# EAGLE design control-surface-right (EAGLE 6.6.0)
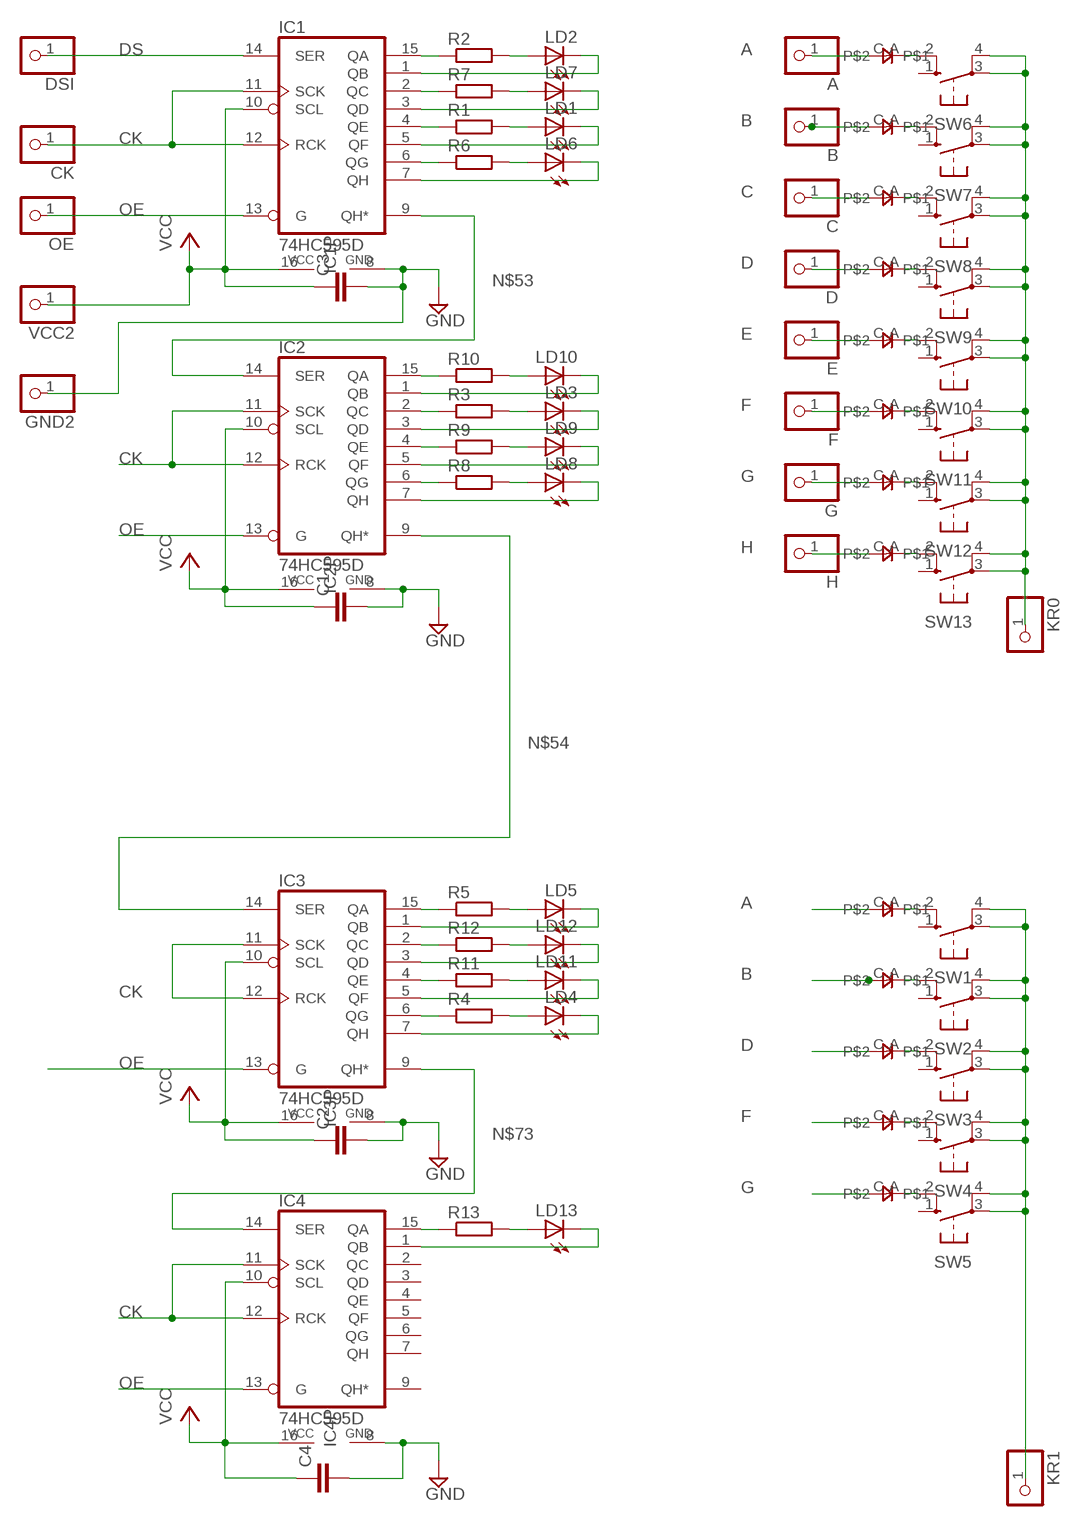
[diagram p0: schematic, sheet 1]

## Parts
A  PINHD-1X1  [1X01]
B  PINHD-1X1  [1X01]
C  PINHD-1X1  [1X01]
C1  C-EUC0805  [C0805]
C2  C-EUC0805  [C0805]
C3  C-EUC0805  [C0805]
C4  C-EUC0805  [C0805]
CK  PINHD-1X1  [1X01]
D  PINHD-1X1  [1X01]
D1  0805DIODE  [0805DIODE]
D2  0805DIODE  [0805DIODE]
D3  0805DIODE  [0805DIODE]
D4  0805DIODE  [0805DIODE]
D5  0805DIODE  [0805DIODE]
D6  0805DIODE  [0805DIODE]
D7  0805DIODE  [0805DIODE]
D8  0805DIODE  [0805DIODE]
D9  0805DIODE  [0805DIODE]
D10  0805DIODE  [0805DIODE]
D11  0805DIODE  [0805DIODE]
D12  0805DIODE  [0805DIODE]
D13  0805DIODE  [0805DIODE]
DSI  PINHD-1X1  [1X01]
E  PINHD-1X1  [1X01]
F  PINHD-1X1  [1X01]
G  PINHD-1X1  [1X01]
GND2  PINHD-1X1  [1X01]
H  PINHD-1X1  [1X01]
IC1  74HC595D  [SO16]
IC2  74HC595D  [SO16]
IC3  74HC595D  [SO16]
IC4  74HC595D  [SO16]
KR0  PINHD-1X1  [1X01]
KR1  PINHD-1X1  [1X01]
LD1  LED3MM  [LED3MM]
LD2  LED3MM  [LED3MM]
LD3  LED3MM  [LED3MM]
LD4  LED3MM  [LED3MM]
LD5  LED3MM  [LED3MM]
LD6  LED3MM  [LED3MM]
LD7  LED3MM  [LED3MM]
LD8  LED3MM  [LED3MM]
LD9  LED3MM  [LED3MM]
LD10  LED3MM  [LED3MM]
LD11  LED3MM  [LED3MM]
LD12  LED3MM  [LED3MM]
LD13  LED3MM  [LED3MM]
OE  PINHD-1X1  [1X01]
R1  R-EU_R0805  [R0805]
R2  R-EU_R0805  [R0805]
R3  R-EU_R0805  [R0805]
R4  R-EU_R0805  [R0805]
R5  R-EU_R0805  [R0805]
R6  R-EU_R0805  [R0805]
R7  R-EU_R0805  [R0805]
R8  R-EU_R0805  [R0805]
R9  R-EU_R0805  [R0805]
R10  R-EU_R0805  [R0805]
R11  R-EU_R0805  [R0805]
R12  R-EU_R0805  [R0805]
R13  R-EU_R0805  [R0805]
SW1  40-XX  [B3F-40XX]
SW2  40-XX  [B3F-40XX]
SW3  40-XX  [B3F-40XX]
SW4  40-XX  [B3F-40XX]
SW5  40-XX  [B3F-40XX]
SW6  40-XX  [B3F-40XX]
SW7  40-XX  [B3F-40XX]
SW8  40-XX  [B3F-40XX]
SW9  40-XX  [B3F-40XX]
SW10  40-XX  [B3F-40XX]
SW11  40-XX  [B3F-40XX]
SW12  40-XX  [B3F-40XX]
SW13  40-XX  [B3F-40XX]
VCC2  PINHD-1X1  [1X01]

## Nets
A: A.1 D1.C D6.C
B: B.1 D2.C D7.C
C: C.1 D8.C
CK: CK.1 IC1.11(SCK) IC1.12(RCK) IC2.11(SCK) IC2.12(RCK) IC3.11(SCK) IC3.12(RCK) IC4.11(SCK) IC4.12(RCK)
D: D3.C D9.C D.1
DS: DSI.1 IC1.14(SER)
E: D10.C E.1
F: D4.C D11.C F.1
G: D5.C D12.C G.1
GND: C1.2 C2.2 C3.2 C4.2 GND2.1 IC1.8(GND) IC2.8(GND) IC3.8(GND) IC4.8(GND)
H: D13.C H.1
N$1: IC1.6(QG) R6.1
N$2: LD6.A R6.2
N$3: IC1.7(QH) LD6.K(C)
N$4: IC1.4(QE) R1.1
N$5: IC1.5(QF) LD1.K(C)
N$6: LD1.A R1.2
N$7: IC1.3(QD) LD7.K(C)
N$8: LD7.A R7.2
N$9: IC1.2(QC) R7.1
N$10: IC1.15(QA) R2.1
N$11: IC1.1(QB) LD2.K(C)
N$12: LD2.A R2.2
N$14: IC2.6(QG) R8.1
N$15: LD8.A R8.2
N$16: IC2.7(QH) LD8.K(C)
N$17: IC2.4(QE) R9.1
N$18: IC2.5(QF) LD9.K(C)
N$19: LD9.A R9.2
N$20: IC2.3(QD) LD3.K(C)
N$21: LD3.A R3.2
N$22: IC2.2(QC) R3.1
N$23: IC2.15(QA) R10.1
N$24: IC2.1(QB) LD10.K(C)
N$25: LD10.A R10.2
N$27: KR0.1 SW6.3(P) SW6.4(P1) SW7.3(P) SW7.4(P1) SW8.3(P) SW8.4(P1) SW9.3(P) SW9.4(P1) SW10.3(P) SW10.4(P1) SW11.3(P) SW11.4(P1) SW12.3(P) SW12.4(P1) SW13.3(P) SW13.4(P1)
N$28: D13.A SW13.2(S1)
N$29: D12.A SW12.2(S1)
N$30: D11.A SW11.2(S1)
N$31: D10.A SW10.2(S1)
N$32: D9.A SW9.2(S1)
N$33: D8.A SW8.2(S1)
N$34: D7.A SW7.2(S1)
N$35: D6.A SW6.2(S1)
N$45: IC3.6(QG) R4.1
N$46: LD4.A R4.2
N$47: IC3.7(QH) LD4.K(C)
N$48: IC3.4(QE) R11.1
N$49: IC3.5(QF) LD11.K(C)
N$50: LD11.A R11.2
N$51: IC3.3(QD) LD12.K(C)
N$52: LD12.A R12.2
N$53: IC1.9(QH*) IC2.14(SER)
N$54: IC2.9(QH*) IC3.14(SER)
N$55: IC3.2(QC) R12.1
N$56: IC3.15(QA) R5.1
N$57: IC3.1(QB) LD5.K(C)
N$58: LD5.A R5.2
N$69: IC4.15(QA) R13.1
N$70: IC4.1(QB) LD13.K(C)
N$71: LD13.A R13.2
N$73: IC3.9(QH*) IC4.14(SER)
N$75: KR1.1 SW1.3(P) SW1.4(P1) SW2.3(P) SW2.4(P1) SW3.3(P) SW3.4(P1) SW4.3(P) SW4.4(P1) SW5.3(P) SW5.4(P1)
N$79: D5.A SW5.2(S1)
N$80: D4.A SW4.2(S1)
N$81: D3.A SW3.2(S1)
N$82: D2.A SW2.2(S1)
N$83: D1.A SW1.2(S1)
OE: IC1.13(G) IC2.13(G) IC3.13(G) IC4.13(G) OE.1
VCC: C1.1 C2.1 C3.1 C4.1 IC1.10(SCL) IC1.16(VCC) IC2.10(SCL) IC2.16(VCC) IC3.10(SCL) IC3.16(VCC) IC4.10(SCL) IC4.16(VCC) VCC2.1
Unconnected: IC4.2(QC) IC4.3(QD) IC4.4(QE) IC4.5(QF) IC4.6(QG) IC4.7(QH) IC4.9(QH*) SW1.1(S) SW2.1(S) SW3.1(S) SW4.1(S) SW5.1(S) SW6.1(S) SW7.1(S) SW8.1(S) SW9.1(S) SW10.1(S) SW11.1(S) SW12.1(S) SW13.1(S)

## Library data of the parts
A B C CK D DSI E F G GND2 H KR0 KR1 OE VCC2 = pinhead:PINHD-1X1: PIN HEADER
C1-C4 = rcl:C-EU: CAPACITOR, European symbol
D1-D13 = jasons_stuff:0805DIODE
IC1-IC4 = 74xx-eu:74*595: 8-bit SHIFT REGISTER, output latch
LD1-LD13 = led:LED: LED OSRAM: - CHIPLED LG R971, LG N971, LY N971, LG Q971, LY Q971, LO R971, LY R971 LH N974, LH R974 LS Q976, LO Q976, LY Q976 LO Q996 - Hyper CHIPLED LW Q18S LB Q993, LB Q99A, LB R99A - SideLED LS A670, LO A670, LY A670, LG A670, LP A670 LB A673, LV A673, LT A673, LW A673 LH A674 LY A675 LS A676, LA A676, LO A676, LY A676, LW A676 LS A679, LY A679, LG A679 - Hyper Micro SIDELED® LS Y876, LA Y876, LO Y876, LY Y876 LT Y87S - SmartLED LW L88C, LW L88S LB L89C, LB L89S, LG L890 LS L89K, LO L89K, LY L89K LS L896, LA L896, LO L896, LY L896 - TOPLED LS T670, LO T670, LY T670, LG T670, LP T670 LSG T670, LSP T670, LSY T670, LOP T670, LYG T670 LG T671, LOG T671, LSG T671 LB T673, LV T673, LT T673, LW T673 LH T674 LS T676, LA T676, LO T676, LY T676, LB T676, LH T676, LSB T676, LW T676 LB T67C, LV T67C, LT T67C, LS T67K, LO T67K, LY T67K, LW E67C LS E67B, LA E67B, LO E67B, LY E67B, LB E67C, LV E67C, LT E67C LW T67C LS T679, LY T679, LG T679 LS T770, LO T770, LY T770, LG T770, LP T770 LB T773, LV T773, LT T773, LW T773 LH T774 LS E675, LA E675, LY E675, LS T675 LS T776, LA T776, LO T776, LY T776, LB T776 LHGB T686 LT T68C, LB T68C - Hyper Mini TOPLED® LB M676 - Mini TOPLED Santana® LG M470 LS M47K, LO M47K, LY M47K Source: http://www.osram.convergy.de LUXEON: - LUMILED® LXK2-PW12-R00, LXK2-PW12-S00, LXK2-PW14-U00, LXK2-PW14-V00 LXK2-PM12-R00, LXK2-PM12-S00, LXK2-PM14-U00 LXK2-PE12-Q00, LXK2-PE12-R00, LXK2-PE12-S00, LXK2-PE14-T00, LXK2-PE14-U00 LXK2-PB12-K00, LXK2-PB12-L00, LXK2-PB12-M00, LXK2-PB14-N00, LXK2-PB14-P00, LXK2-PB14-Q00 LXK2-PR12-L00, LXK2-PR12-M00, LXK2-PR14-Q00, LXK2-PR14-R00 LXK2-PD12-Q00, LXK2-PD12-R00, LXK2-PD12-S00 LXK2-PH12-R00, LXK2-PH12-S00 LXK2-PL12-P00, LXK2-PL12-Q00, LXK2-PL12-R00 Source: www.luxeon.com KINGBRIGHT: KA-3528ASYC Source: www.kingbright.com
R1-R13 = rcl:R-EU_: RESISTOR, European symbol
SW1-SW13 = switch-omron:40-XX: OMRON SWITCH; MF: OMRON COMPONENTS USA; MPN: B3F-4000; OC_FARNELL: 176434; OC_NEWARK: 36K3105

## Board
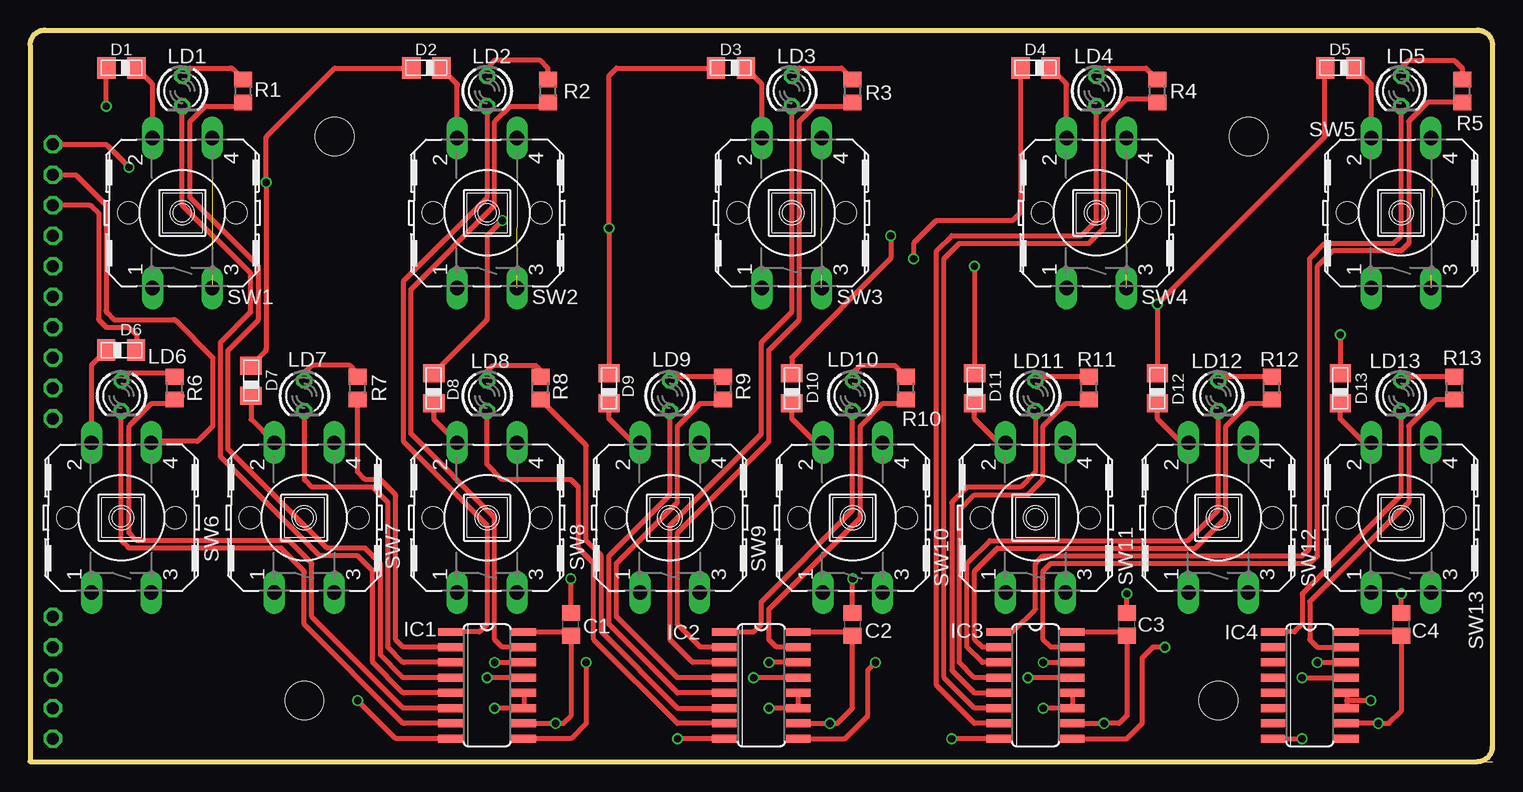
[diagram p1: board, top side]
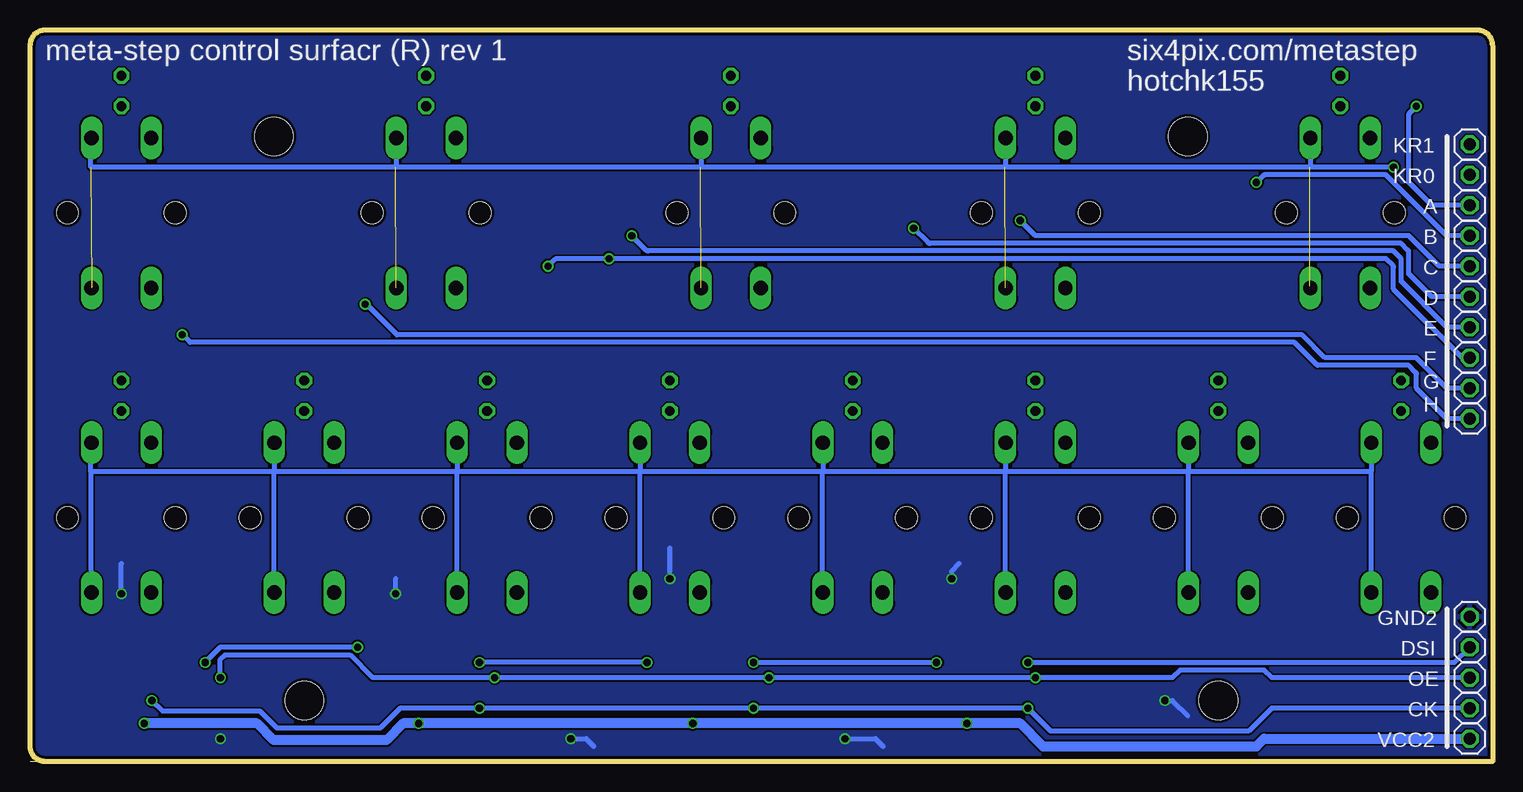
[diagram p2: board, bottom side, seen from below]

Size 121.92 x 60.96 mm. Coordinates in mm from the lower left corner, seen from the top.
Outline: 0,0 121.92,0
Outline: 0,0 0,59.69 arc-90 1.27,60.96 120.65,60.96 arc-90 121.92,59.69 121.92,1.27 arc-90 120.65,0 0,0
Copper layers (1*16): Top 0.035mm / dielectric 1.5mm / Bottom 0.035mm
Design rules "ITEADstudio_DRC": minimum track width 6mil, minimum drill 12mil, track to track 6mil, track to pad 6mil, pad to pad 6mil, via to via 6mil, smd to smd 0mil, copper to edge 10mil, drill to drill 10mil, minimum pad ring 10mil, minimum via ring 6mil, stop-mask expansion 2mil, vias tented up to drill 100mil, thermal gap 10mil
Holes 3.2 mm at 25.4,52.07 101.6,52.07 22.86,5.08 99.06,5.08

### Footprints (pad centres in the part's own frame; a part is rotated, then mirrored left to right if it is on the bottom)
1X01 = drill 1.016 octagon: 1 0,0
C0805 = smd 1.3 x 1.5: 1 -0.95,0; 2 0.95,0
0805DIODE = smd 1.524 x 1.778: A -1.262,-0.005; C 1.238,-0.005
SO16 = smd 0.66 x 2.032: 1 -4.445,-3.073; 2 -3.175,-3.073; 3 -1.905,-3.073; 4 -0.635,-3.073; 5 0.635,-3.073; 6 1.905,-3.073; 7 3.175,-3.073; 8 4.445,-3.073; 9 4.445,3.073; 10 3.175,3.073; 11 1.905,3.073; 12 0.635,3.073; 13 -0.635,3.073; 14 -1.905,3.073; 15 -3.175,3.073; 16 -4.445,3.073
LED3MM = drill 0.813 octagon: A -1.27,0; K 1.27,0
R0805 = smd 1.3 x 1.5: 1 -0.95,0; 2 0.95,0
B3F-40XX = drill 1.194 long: 1 -6.248,2.489; 2 6.248,2.489; 3 -6.248,-2.489; 4 6.248,-2.489 | hole 1.803: 0,-4.496; 0,4.496

### Placement (x,y rotation side)
A  1.9,46.35 0 bottom
B  1.9,43.81 0 bottom
C  1.9,41.27 0 bottom
C1  45.09,11.43 90 top
C2  68.58,11.43 90 top
C3  91.44,11.43 90 top
C4  114.3,11.43 90 top
CK  1.9,4.45 0 bottom
D  1.9,38.73 0 bottom
D1  7.62,57.78 180 top
D2  33.02,57.78 180 top
D3  58.42,57.78 180 top
D4  83.82,57.78 180 top
D5  109.22,57.78 180 top
D6  7.62,34.29 0 top
D7  18.41,31.75 90 top
D8  33.66,31.11 90 top
D9  48.26,31.11 90 top
D10  63.5,31.11 90 top
D11  78.74,31.11 90 top
D12  93.98,31.11 90 top
D13  109.22,31.11 90 top
DSI  1.9,9.53 0 bottom
E  1.9,36.2 0 bottom
F  1.9,33.66 0 bottom
G  1.9,31.11 0 bottom
GND2  1.9,12.06 0 bottom
H  1.9,28.57 0 bottom
IC1  38.1,6.35 270 top
IC2  60.96,6.35 270 top
IC3  83.82,6.35 270 top
IC4  106.68,6.35 270 top
KR0  1.9,48.9 0 bottom
KR1  1.9,51.44 0 bottom
LD1  12.7,55.88 270 top
LD2  38.1,55.88 270 top
LD3  63.5,55.88 270 top
LD4  88.9,55.88 270 top
LD5  114.3,55.88 270 top
LD6  7.62,30.48 270 top
LD7  22.86,30.48 270 top
LD8  38.1,30.48 270 top
LD9  53.34,30.48 270 top
LD10  68.58,30.48 270 top
LD11  83.82,30.48 270 top
LD12  99.06,30.48 270 top
LD13  114.3,30.48 270 top
OE  1.9,6.99 0 bottom
R1  17.78,55.88 90 top
R2  43.18,55.88 90 top
R3  68.58,55.88 90 top
R4  93.98,55.88 90 top
R5  119.38,55.88 90 top
R6  12.06,31.11 90 top
R7  27.3,31.11 90 top
R8  42.55,31.11 90 top
R9  57.78,31.11 90 top
R10  73.03,31.11 90 top
R11  88.27,31.11 90 top
R12  103.5,31.11 90 top
R13  118.75,31.11 90 top
SW1  12.7,45.72 90 top
SW2  38.1,45.72 90 top
SW3  63.5,45.72 90 top
SW4  88.9,45.72 90 top
SW5  114.3,45.72 90 top
SW6  7.62,20.32 90 top
SW7  22.86,20.32 90 top
SW8  38.1,20.32 90 top
SW9  53.34,20.32 90 top
SW10  68.58,20.32 90 top
SW11  83.82,20.32 90 top
SW12  99.06,20.32 90 top
SW13  114.3,20.32 90 top
VCC2  1.9,1.91 0 bottom

### Tracks (layer width: path | path; a pad name or v marks a point on that pad's centre or on a via)
A  (via drill 0.6)
  Top 0.406: D6.C arc45 8.89,34.36 8.89,35.56 8.33,36.12 arc45 8.15,36.2 6.35,36.2 5.79,36.76 arc-45 5.71,36.94 5.71,45.72 5.15,46.28 arc45 4.97,46.35 A.1 | v6.35,54.61 6.35,57.71 arc-45 D1.C
  Bottom 0.406: A.1 4.97,46.35 arc45 5.15,46.43 6.98,48.26 6.98,53.87 arc45 6.91,54.05 v6.35,54.61
B  (via drill 0.6)
  Top 0.406: D7.C 19.61,34.18 arc45 19.69,34.36 v19.69,48.26 19.69,51.97 arc-45 19.76,52.14 25.4,57.78 D2.C arc45 D2.C
  Bottom 0.406: B.1 3.7,43.81 arc45 3.88,43.89 8.89,48.9 18.95,48.9 arc-45 19.12,48.82 v19.69,48.26
C  (via drill 0.6)
  Top 0.406: v39.37,45.09 38.1,43.81 38.1,36.9 arc-45 38.03,36.72 D8.C
  Bottom 0.406: C.1 4.34,41.27 arc45 4.52,41.35 6.98,43.81 37.99,43.81 arc45 38.17,43.89 v39.37,45.09
CK  (via drill 0.6)
  Top 0.406: v61.59,4.45 IC2.11 IC2.12 | v38.73,4.45 IC1.11 IC1.12 | IC3.12 IC3.11 v84.45,4.45 | IC4.12 109.75,5.08 | 109.75,5.08 IC4.11 | v111.76,5.08 109.75,5.08
  Bottom 0.406: CK.1 18.41,4.45 20.32,2.54 36.83,2.54 v38.73,4.45 v61.59,4.45 v84.45,4.45 91.06,4.45 92.71,2.79 101.35,2.79 102.74,4.19 110.87,4.19 v111.76,5.08
D  (via drill 0.6)
  Top 0.406: D9.C arc-45 48.26,32.37 v48.26,44.45 48.26,57.05 arc-45 48.33,57.22 48.89,57.78 D3.C arc45 D3.C
  Bottom 0.406: D.1 4.97,38.73 arc45 5.15,38.81 6.98,40.64 6.98,42.44 arc-45 7.06,42.62 7.62,43.18 46.89,43.18 arc45 47.06,43.25 v48.26,44.45
DS  (via drill 0.6)
  Top 0.406: v38.73,8.26 IC1.14
  Bottom 0.406: v38.73,8.26 3.17,8.26 DSI.1
E  (via drill 0.6)
  Top 0.406: v71.75,43.81 71.75,42.02 arc-45 71.68,41.84 63.5,33.66 63.5,32.37 arc45 D10.C
  Bottom 0.406: E.1 3.7,36.2 arc45 3.88,36.27 7.62,40.01 7.62,41.8 arc-45 7.69,41.98 8.25,42.55 70.38,42.55 arc45 70.56,42.62 v71.75,43.81
F  (via drill 0.6)
  Top 0.406: v78.74,41.27 78.74,32.37 arc45 D11.C | D4.C 82.58,45.86 arc-45 82.51,45.68 81.91,45.09 75.67,45.09 arc45 75.49,45.01 73.66,43.18 v73.66,41.91
  Bottom 0.406: v78.74,41.27 78.18,41.84 arc45 78,41.91 74.93,41.91 v73.66,41.91 8.89,41.91 8.33,41.35 arc45 8.25,41.17 8.25,39.37 2.54,33.66 F.1
G  (via drill 0.6)
  Top 0.406: D12.C arc-45 93.98,32.37 v93.98,38.1 107.95,52.07 107.95,57.71 arc-45 D5.C
  Bottom 0.406: G.1 3.7,31.11 arc45 3.88,31.19 6.35,33.66 13.97,33.66 15.88,35.56 91.33,35.56 93.88,38.1 v93.98,38.1
GND  (via drill 0.6)
  Top 0.406: IC1.8 30.48,1.91 v27.3,5.08 | IC2.8 v53.97,1.91 | IC3.8 v76.83,1.91 | IC4.8 v106.05,1.91 | C4.2 v114.3,13.97 | C3.2 v91.44,13.97 | C2.2 v68.58,15.24 | C1.2 v45.09,15.24
  Bottom 0.406: v27.3,5.08 26.67,5.08 25.4,3.81 | v53.97,1.91 51.44,1.91 50.8,1.27 | v76.83,1.91 75.56,1.91 74.93,1.27 | v114.3,13.97 114.3,16.51 | v91.44,13.97 91.44,15.24 | v68.58,15.24 68.58,17.78 | v45.09,15.24 45.09,15.88 44.45,16.51
  pour Bottom: -1.27,64.77 -1.27,-3.81 -1.27,-6.35 125.73,-6.35 125.73,64.77 127,64.77 127,67.31 -1.27,67.31
H  (via drill 0.6)
  Top 0.406: v109.22,35.56 109.22,32.37 arc45 D13.C
  Bottom 0.406: H.1 3.7,28.57 arc45 3.88,28.65 6.35,31.11 6.35,32.28 arc-45 6.42,32.46 6.98,33.02 14.6,33.02 16.51,34.92 108.58,34.92 v109.22,35.56
N$1
  Top 0.406: IC1.6 31.22,4.45 arc-45 31.04,4.52 23.49,12.06 23.49,16.41 arc45 23.42,16.58 21.59,18.41 8.99,18.41 arc-45 8.82,18.49 8.25,19.05 8.25,27.84 arc-45 8.33,28.01 10.16,29.84 11.96,29.84 arc45 12.14,29.92 12.7,30.48 12.48,30.48 arc45 12.31,30.41 R6.1
N$2
  Top 0.406: LD6.A 8.25,32.38 11.64,32.38 arc-45 11.82,32.31 R6.2
N$3
  Top 0.406: IC1.7 31.22,3.17 arc-45 31.04,3.25 22.86,11.43 22.86,15.77 arc45 22.79,15.95 20.95,17.78 8.36,17.78 arc-45 8.18,17.85 7.62,18.41 LD6.K
N$4
  Top 0.406: IC1.4 31.22,6.99 arc-45 31.04,7.06 29.21,8.89 29.21,16.41 arc45 29.14,16.58 27.94,17.78 24.87,17.78 arc-45 24.69,17.85 16.51,26.04 16.51,34.19 arc-45 16.58,34.36 19.05,36.83 19.05,41.17 arc45 18.98,41.35 13.33,46.99 13.33,53.23 arc-45 13.41,53.41 14.6,54.61 17.35,54.61 arc45 17.53,54.68 R1.1
N$5
  Top 0.406: IC1.5 31.22,5.71 arc-45 31.04,5.79 28.57,8.26 28.57,15.77 arc45 28.5,15.95 27.3,17.14 24.23,17.14 arc-45 24.06,17.22 15.88,25.4 15.88,34.82 arc-45 15.95,35 18.41,37.47 18.41,40.53 arc45 18.34,40.71 12.7,46.35 LD1.K
N$6
  Top 0.406: LD1.A 13.33,57.78 16.72,57.78 arc-45 16.9,57.71 R1.2
N$7
  Top 0.406: IC1.3 31.22,8.26 arc-45 31.04,8.33 29.84,9.53 29.84,21.48 arc45 29.77,21.66 28.57,22.86 23.49,22.86 22.93,23.42 arc-45 22.86,23.6 LD7.K
N$8
  Top 0.406: R7.2 27.3,32.28 arc45 27.23,32.46 26.67,33.02 23.6,33.02 arc45 23.42,32.95 22.86,32.38 LD7.A
N$9
  Top 0.406: IC1.2 31.22,9.53 arc-45 31.04,9.6 30.48,10.16 30.48,22.12 arc45 30.41,22.3 29.21,23.5 28.05,23.5 arc-45 27.87,23.57 27.3,24.13 R7.1
N$10
  Top 0.406: IC1.15 39.37,9.53 38.73,10.16 38.73,20.32 31.75,27.3 31.75,39.37 38.73,46.35 38.73,53.34 40,54.61 42.86,54.61 R2.1
N$11
  Top 0.406: LD2.K 38.1,46.99 31.12,40.01 31.12,26.77 arc45 31.19,26.6 38.1,19.68 38.1,11.54 arc-45 38.03,11.36 37.46,10.79 IC1.1
N$12
  Top 0.406: R2.2 43.18,57.78 42.55,58.42 38.73,58.42 38.1,57.78 LD2.A
N$14
  Top 0.406: R8.1 46.36,26.36 46.36,18.41 47.62,17.14 47.62,10.79 53.97,4.45 IC2.6
N$15
  Top 0.406: LD8.A 38.1,32.51 38.61,33.02 42.16,33.02 42.42,32.77 42.42,32.19 R8.2
N$16
  Top 0.406: IC2.7 53.97,3.17 46.99,10.16 46.99,16.51 45.72,17.78 45.72,22.86 45.09,23.5 39.37,23.5 38.1,24.77 LD8.K
N$17
  Top 0.406: IC2.4 53.97,6.99 48.89,12.06 48.89,16.51 53.97,21.59 53.97,27.94 55.88,29.84 57.47,29.84 R9.1
N$18
  Top 0.406: LD9.K 53.34,22.23 48.26,17.14 48.26,11.43 53.97,5.71 IC2.5
N$19
  Top 0.406: R9.2 53.66,32.06 LD9.A
N$20
  Top 0.406: IC2.3 55.25,8.26 53.34,10.16 53.34,19.68 60.96,27.3 60.96,34.92 63.5,37.47 LD3.K
N$21
  Top 0.406: LD3.A 64.14,57.78 67.62,57.78 R3.2
N$22
  Top 0.406: IC2.2 55.88,9.53 53.97,11.43 53.97,19.05 61.59,26.67 61.59,34.29 64.14,36.83 64.14,53.34 65.41,54.61 68.26,54.61 R3.1
N$23
  Top 0.406: IC2.15 62.23,9.53 61.59,10.16 61.59,12.7 69.22,20.32 69.22,27.94 71.12,29.84 72.7,29.84 R10.1
N$24
  Top 0.406: IC2.1 60.33,10.79 60.96,11.43 60.96,13.34 68.58,20.95 LD10.K
N$25
  Top 0.406: LD10.A 68.58,32.38 69.22,33.02 72.07,33.02 R10.2
N$27
  Top 0.406: KR0.1 3.7,48.9 arc-45 3.88,48.82 6.35,46.35 6.35,37.57 arc45 6.42,37.39 6.98,36.83 11.96,36.83 arc-45 12.14,36.76 15.24,33.66 15.24,28.05 arc-45 15.17,27.87 13.97,26.67 10.32,26.67 arc45 10.14,26.6 SW6.4
  Bottom 0.406: SW6.4 10.11,24.18 10.16,24.13 | 10.16,24.13 25.4,24.13 | 25.4,24.13 40.64,24.13 | 40.64,24.13 55.88,24.13 | 55.88,24.13 71.12,24.13 | 71.12,24.13 86.36,24.13 | 86.36,24.13 101.6,24.13 | 101.6,24.13 116.84,24.13 | 116.84,24.13 116.84,26.52 SW13.4 | SW12.4 101.55,24.18 101.6,24.13 | SW11.4 86.31,24.18 86.36,24.13 | SW10.4 71.07,24.18 71.12,24.13 | SW9.4 55.83,24.18 55.88,24.13 | SW8.4 40.59,24.18 40.64,24.13 | SW7.4 25.35,24.18 25.4,24.13 | 10.16,24.13 10.16,14.12 SW6.3 | 25.4,24.13 25.4,14.12 SW7.3 | 40.64,24.13 40.64,14.02 | 40.64,13.97 40.64,14.02 | 40.64,14.02 SW8.3 | 55.88,24.13 55.88,14.12 SW9.3 | 71.12,24.13 71.12,14.12 SW10.3 | 86.36,24.13 86.36,14.12 SW11.3 | 101.6,24.13 101.6,14.12 SW12.3 | 116.84,24.13 116.84,14.12 SW13.3
N$28
  Top 0.406: SW13.2 111.23,26.57 109.22,28.57 D13.A
N$29
  Top 0.406: SW12.2 95.99,26.57 93.98,28.57 D12.A
N$30
  Top 0.406: SW11.2 80.75,26.57 78.74,28.57 D11.A
N$31
  Top 0.406: SW10.2 65.51,26.57 63.5,28.57 D10.A
N$32
  Top 0.406: SW9.2 50.27,26.57 48.26,28.57 D9.A
N$33
  Top 0.406: D8.A 33.66,28.52 SW8.2
N$34
  Top 0.406: D7.A 18.42,28.52 SW7.2
N$35
  Top 0.406: SW6.2 5.13,33.06 D6.A
N$45
  Top 0.406: IC3.6 78.74,4.45 76.2,6.99 76.2,41.91 77.47,43.18 88.27,43.18 89.53,44.45 89.53,53.34 91.44,55.24 93.66,55.24 R4.1
N$46
  Top 0.406: LD4.A 89.53,57.78 93.03,57.78 R4.2
N$47
  Top 0.406: IC3.7 78.74,3.17 75.56,6.35 75.56,42.55 76.83,43.81 87.63,43.81 88.9,45.09 LD4.K
N$48
  Top 0.406: IC3.4 78.74,6.99 77.47,8.26 77.47,20.95 78.74,22.23 83.19,22.23 84.45,23.5 84.45,27.94 86.36,29.84 87.94,29.84 R11.1
N$49
  Top 0.406: LD11.K 83.82,24.13 82.55,22.86 78.11,22.86 76.83,21.59 76.83,7.62 78.74,5.71 IC3.5
N$50
  Top 0.406: R11.2 84.14,32.06 LD11.A
N$51
  Top 0.406: IC3.3 79.38,8.26 78.11,9.53 78.11,16.51 80.01,18.41 96.52,18.41 99.06,20.95 LD12.K
N$52
  Top 0.406: R12.2 99.38,32.06 LD12.A
N$53  (via drill 0.6)
  Top 0.406: IC2.14 v61.59,8.26 | v46.36,8.26 46.36,3.17 45.09,1.91 IC1.9
  Bottom 0.406: v61.59,8.26 v46.36,8.26
N$54  (via drill 0.6)
  Top 0.406: IC2.9 67.94,1.91 69.85,3.81 69.85,7.62 v70.48,8.26 | v84.45,8.26 IC3.14
  Bottom 0.406: v70.48,8.26 v84.45,8.26
N$55
  Top 0.406: IC3.2 79.38,9.53 78.74,10.16 78.74,15.88 80.64,17.78 97.16,17.78 99.69,20.32 99.69,27.94 101.6,29.84 103.19,29.84 R12.1
N$56
  Top 0.406: IC3.15 85.09,9.53 84.45,10.16 84.45,15.88 85.09,16.51 106.68,16.51 107.31,17.14 107.31,41.27 108.58,42.55 114.3,42.55 114.94,43.18 114.94,53.34 116.53,54.93 R5.1
N$57
  Top 0.406: IC3.1 81.91,10.79 83.82,12.7 83.82,16.51 84.45,17.14 106.05,17.14 106.68,17.78 106.68,41.91 107.95,43.18 113.66,43.18 114.3,43.81 LD5.K
N$58
  Top 0.406: LD5.A 114.3,57.68 arc-45 114.37,57.86 114.94,58.42 118.64,58.42 arc-45 118.82,58.35 119.38,57.78 R5.2
N$69
  Top 0.406: R13.1 117.16,30.16 114.94,27.94 114.94,21.59 106.68,13.34 106.68,10.16 107.31,9.53 IC4.15
N$70
  Top 0.406: LD13.K 114.3,22.23 106.05,13.97 106.05,11.43 105.41,10.79 IC4.1
N$71
  Top 0.406: R13.2 114.62,32.06 LD13.A
N$73  (via drill 0.6)
  Top 0.406: IC3.9 91.44,1.91 92.71,3.17 92.71,8.64 93.6,9.53 v94.61,9.53 | v107.31,8.26 IC4.14
  Bottom 0.406: v94.61,9.53 106.05,9.53 v107.31,8.26
N$75  (via drill 0.6)  (5 unrouted)
  Top 0.406: 15.24,39.59 arc-45 SW1.3 | KR1.1 6.24,51.44 arc-45 6.42,51.36 v8.25,49.53
  Bottom 0.406: SW1.4 15.19,49.65 arc45 15.24,49.53 | 15.24,49.53 40.64,49.53 | 40.64,49.53 66.04,49.53 | 66.04,49.53 91.44,49.53 | 91.44,49.53 116.84,49.53 116.84,51.85 arc45 SW5.4 | SW4.4 91.39,49.65 arc45 91.44,49.53 | SW3.4 65.99,49.65 arc45 66.04,49.53 | SW2.4 40.59,49.65 arc45 40.64,49.53 | v8.25,49.53 15.24,49.53
N$79
  Top 0.406: SW5.2 111.81,56.36 arc45 111.74,56.53 D5.A
N$80
  Top 0.406: SW4.2 86.41,56.36 arc45 86.34,56.53 D4.A
N$81
  Top 0.406: SW3.2 61.01,56.36 arc45 60.94,56.53 D3.A
N$82
  Top 0.406: SW2.2 35.61,56.36 arc45 35.54,56.53 D2.A
N$83
  Top 0.406: SW1.2 10.21,56.36 arc45 10.14,56.53 D1.A
OE  (via drill 0.6)
  Top 0.406: v106.05,6.99 IC4.13 | IC3.13 v83.19,6.99 | IC2.13 v60.33,6.99 | IC1.13 v38.1,6.99
  Bottom 0.406: OE.1 18.41,6.99 19.05,7.62 26.03,7.62 26.67,6.99 v38.1,6.99 v60.33,6.99 v83.19,6.99 93.34,6.99 95.25,8.89 105.66,8.89 106.05,8.51 v106.05,6.99
VCC  (via drill 0.6)
  Top 0.406: IC4.10 v112.4,3.17 113.28,3.17 114.3,4.19 C4.1 113.98,10.79 IC4.16 | IC3.10 v89.53,3.17 90.8,3.17 91.44,3.81 C3.1 91.12,10.79 IC3.16 | IC2.10 v66.67,3.17 67.31,3.17 68.58,4.45 C2.1 68.27,10.79 IC2.16 | IC1.10 v43.81,3.17 44.45,3.17 45.09,3.81 C1.1 44.77,10.79 IC1.16
  Bottom 0.813: VCC2.1 19.05,1.91 19.69,1.27 37.46,1.27 39.37,3.17 v43.81,3.17 v66.67,3.17 v89.53,3.17 90.8,3.17 92.2,1.78 101.6,1.78 103,3.17 v112.4,3.17

### Text on the board
bNames: six4pix.com/metastep | meta-step control surfacr (R) rev 1 | hotchk155